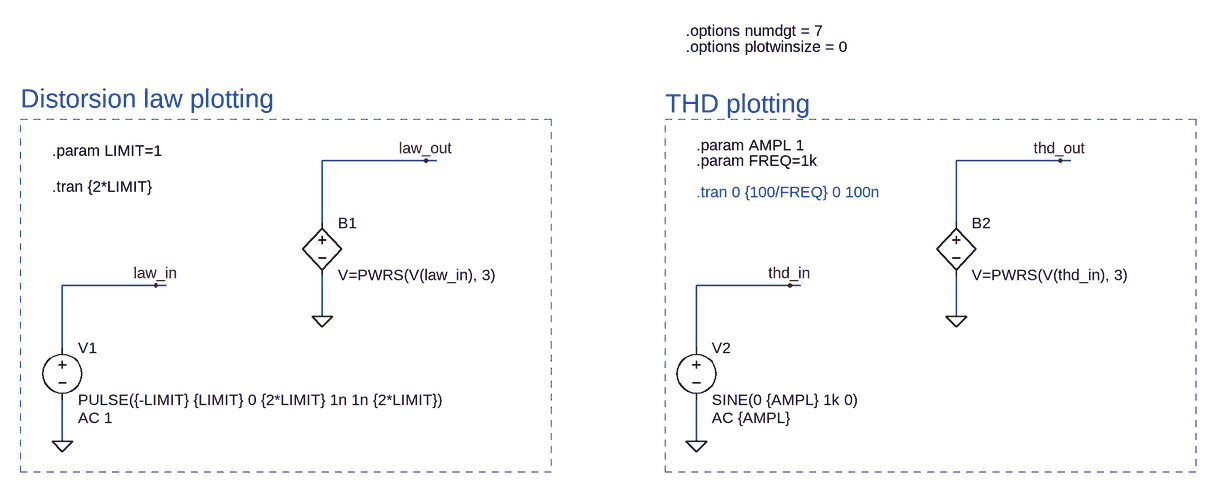
[diagram p0: schematic cubic.asc]
cubic.asc, the LTspice schematic file:
Version 4
SHEET 1 1652 680
WIRE 464 -192 304 -192
WIRE 480 -192 464 -192
WIRE 1440 -192 1280 -192
WIRE 1456 -192 1440 -192
WIRE 304 -96 304 -192
WIRE 1280 -96 1280 -192
WIRE 48 0 -96 0
WIRE 64 0 48 0
WIRE 1024 0 880 0
WIRE 1040 0 1024 0
WIRE 304 48 304 -16
WIRE 1280 48 1280 -16
WIRE -96 96 -96 0
WIRE 880 96 880 0
WIRE -96 240 -96 176
WIRE 880 240 880 176
FLAG -96 240 0
FLAG 48 0 law_in
FLAG 304 48 0
FLAG 464 -192 law_out
FLAG 880 240 0
FLAG 1024 0 thd_in
FLAG 1280 48 0
FLAG 1440 -192 thd_out
SYMBOL External\\voltage -96 80 R0
WINDOW 123 24 124 Left 2
WINDOW 39 0 0 Left 0
SYMATTR Value2 AC 1
SYMATTR InstName V1
SYMATTR Value PULSE({-LIMIT} {LIMIT} 0 {2*LIMIT} 1n 1n {2*LIMIT})
SYMBOL bv 304 -112 R0
SYMATTR InstName B1
SYMATTR Value V=PWRS(V(law_in), 3)
SYMBOL External\\voltage 880 80 R0
WINDOW 123 24 124 Left 2
WINDOW 39 0 0 Left 0
SYMATTR Value2 AC {AMPL}
SYMATTR InstName V2
SYMATTR Value SINE(0 {AMPL} 1k 0)
SYMBOL bv 1280 -112 R0
SYMATTR InstName B2
SYMATTR Value V=PWRS(V(thd_in), 3)
TEXT -112 -152 Left 2 !.tran {2*LIMIT}
TEXT -112 -208 Left 2 !.param LIMIT=1
TEXT 880 -216 Left 2 !.param AMPL 1
TEXT -160 -288 Left 4 ;Distorsion law plotting
TEXT 832 -280 Left 4 ;THD plotting
TEXT 880 -144 Left 2 ;.tran 0 {100/FREQ} 0 100n
TEXT 880 -192 Left 2 !.param FREQ=1k
TEXT 864 -392 Left 2 !.options numdgt = 7
TEXT 864 -368 Left 2 !.options plotwinsize = 0
RECTANGLE Normal 656 288 -160 -256 2
RECTANGLE Normal 1648 288 832 -256 2

The netlist it stands for:
* cubic.asc
V1 law_in 0 PULSE({-LIMIT} {LIMIT} 0 {2*LIMIT} 1n 1n {2*LIMIT}) AC 1
B1 law_out 0 V=PWRS(V(law_in), 3)
V2 thd_in 0 SINE(0 {AMPL} 1k 0) AC {AMPL}
B2 thd_out 0 V=PWRS(V(thd_in), 3)
.tran {2*LIMIT}
.param LIMIT=1
.param AMPL 1
* Distorsion law plotting
* THD plotting
* .tran 0 {100/FREQ} 0 100n
.param FREQ=1k
.options numdgt = 7
.options plotwinsize = 0
.backanno
.end